# Altium schematic sheet nRF24L01+.SchDoc
size A4
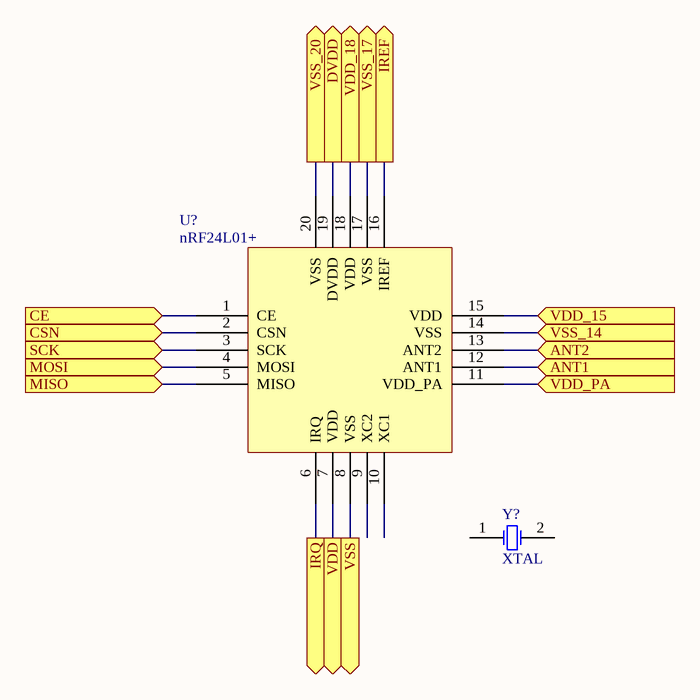
[diagram p0: nRF24L01+.SchDoc]

## Parts
U?  nRF24L01+  [20-VFQFN]
Y?  XTAL  [R38]

## Ports
ANT1, ANT2, CE, CSN, DVDD, IREF, IRQ, MISO, MOSI, SCK, VDD, VDD_15, VDD_18, VDD_PA, VSS, VSS_14, VSS_17, VSS_20

## Nets
ANT1: U?.12(ANT1) ; port ANT1
ANT2: U?.13(ANT2) ; port ANT2
CE: U?.1(CE) ; port CE
CSN: U?.2(CSN) ; port CSN
DVDD: U?.19(DVDD) ; port DVDD
IREF: U?.16(IREF) ; port IREF
IRQ: U?.6(IRQ) ; port IRQ
MISO: U?.5(MISO) ; port MISO
MOSI: U?.4(MOSI) ; port MOSI
SCK: U?.3(SCK) ; port SCK
VDD: U?.7(VDD) ; port VDD
VDD_15: U?.15(VDD) ; port VDD_15
VDD_18: U?.18(VDD) ; port VDD_18
VDD_PA: U?.11(VDD_PA) ; port VDD_PA
VSS: U?.8(VSS) ; port VSS
VSS_14: U?.14(VSS) ; port VSS_14
VSS_17: U?.17(VSS) ; port VSS_17
VSS_20: U?.20(VSS) ; port VSS_20

Not connected (* = marked no-connect by the designer): U? 9(XC2) 10(XC1); Y? 1(OSC1) 2(OSC2)

## Library data of the parts
U? = nRF24L01+: 2.4GHz RF Transceiver
Y? = XTAL: Crystal Oscillator; Published: 8-Jun-2000; LatestRevisionDate: 17-Jul-2002; LatestRevisionNote: Re-released for DXP Platform.; PackageReference: R38; Publisher: Altium Limited; PackageDescription: Crystal, Thru-Hole; 2 Leads; Body 3.1 x 8.2 mm (Dia.xH)